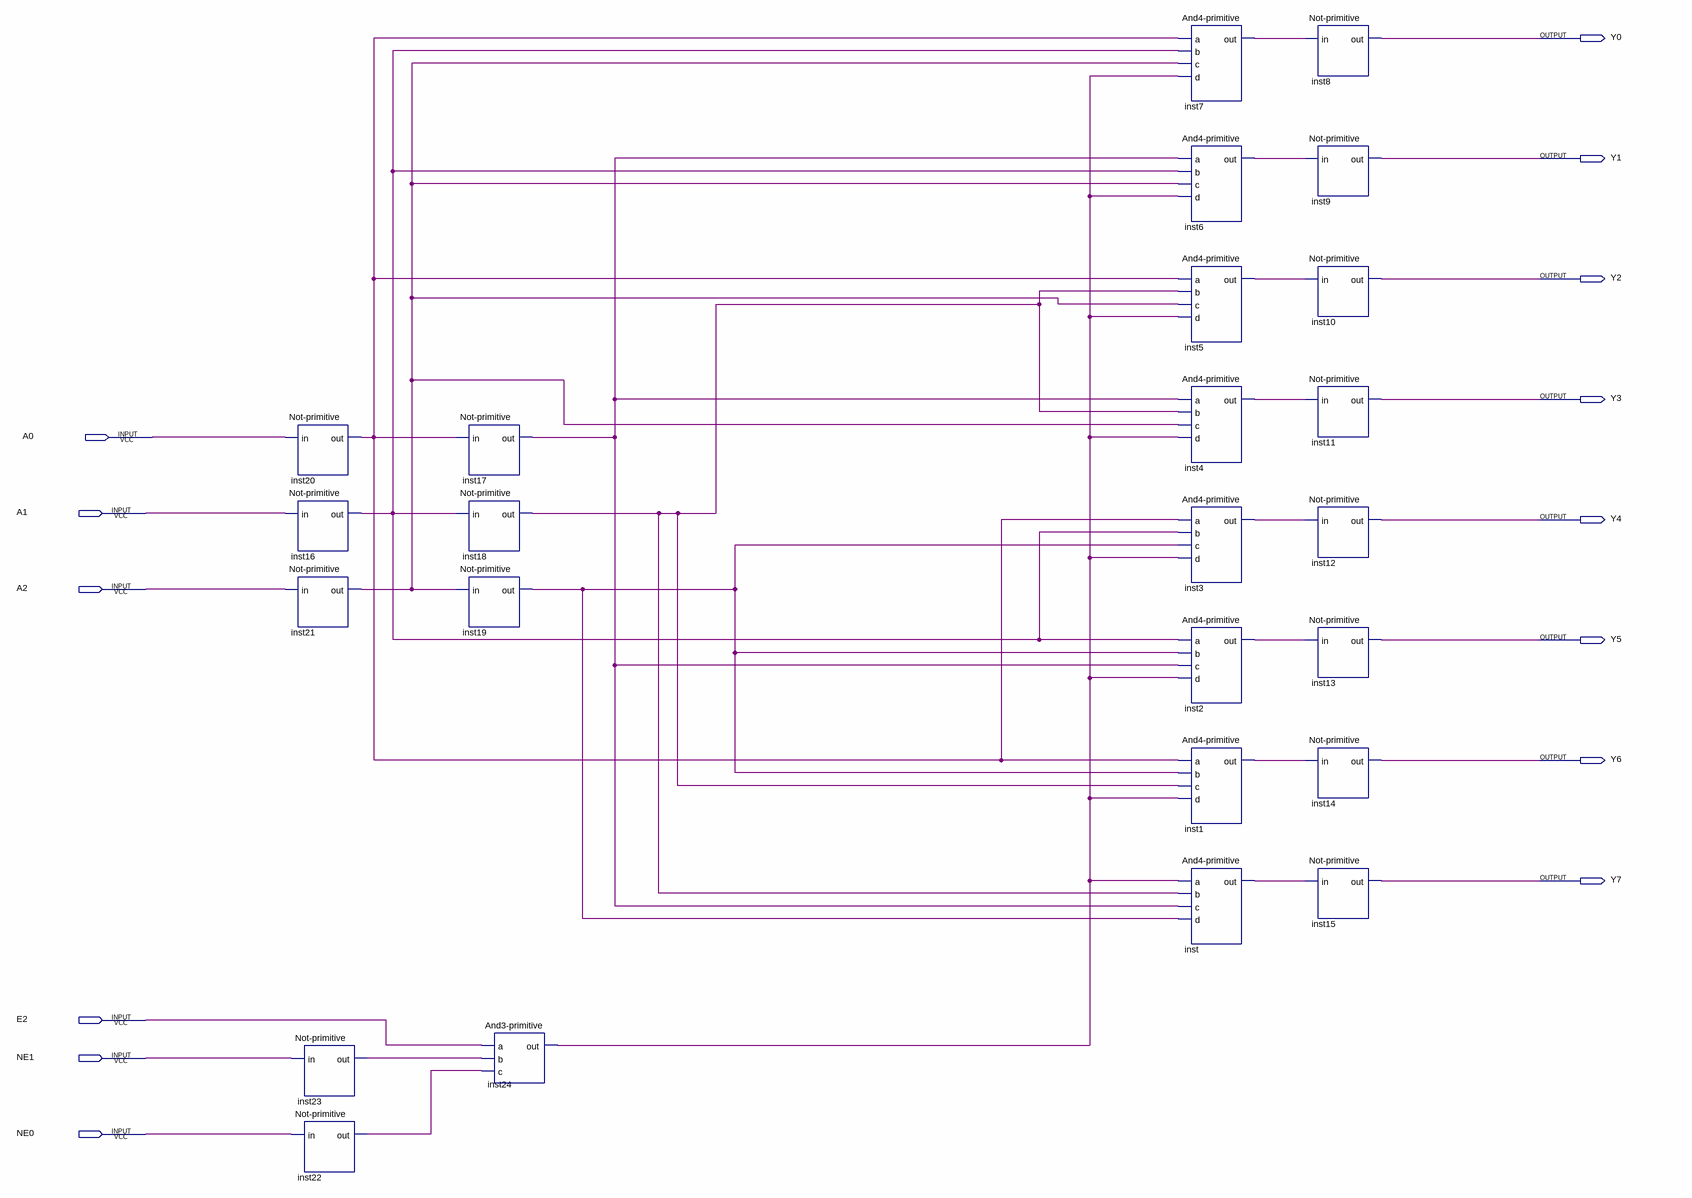
[diagram p0: schematic sheet]
// Quartus schematic 74138-Decoder.bdf as structural Verilog: 25 symbols, 14 pins
module \74138-Decoder  (
  input  A0,
  input  A1,
  input  A2,
  input  E2,
  input  NE1,
  input  NE0,
  output Y0,
  output Y1,
  output Y2,
  output Y3,
  output Y4,
  output Y5,
  output Y6,
  output Y7
);

  wire inst1_out, inst2_out, inst3_out, inst4_out, inst5_out, inst6_out, inst7_out, inst16_out, inst17_out,
       inst18_out, inst19_out, inst20_out, inst21_out, inst22_out, inst23_out, inst24_out, inst_out;

  \Not-primitive  inst20 (.in(A0), .out(inst20_out));
  \Not-primitive  inst16 (.in(A1), .out(inst16_out));
  \Not-primitive  inst21 (.in(A2), .out(inst21_out));
  \Not-primitive  inst23 (.in(NE1), .out(inst23_out));
  \Not-primitive  inst22 (.in(NE0), .out(inst22_out));
  \Not-primitive  inst17 (.in(inst20_out), .out(inst17_out));
  \Not-primitive  inst18 (.in(inst16_out), .out(inst18_out));
  \Not-primitive  inst19 (.in(inst21_out), .out(inst19_out));
  \And3-primitive  inst24 (.a(E2), .b(inst23_out), .c(inst22_out), .out(inst24_out));
  \And4-primitive  inst7 (.a(inst20_out), .b(inst16_out), .c(inst21_out), .d(inst24_out), .out(inst7_out));
  \And4-primitive  inst6 (.a(inst17_out), .b(inst16_out), .c(inst21_out), .d(inst24_out), .out(inst6_out));
  \And4-primitive  inst5 (.a(inst20_out), .b(inst18_out), .c(inst21_out), .d(inst24_out), .out(inst5_out));
  \And4-primitive  inst4 (.a(inst17_out), .b(inst18_out), .c(inst21_out), .d(inst24_out), .out(inst4_out));
  \And4-primitive  inst3 (.a(inst20_out), .b(inst16_out), .c(inst19_out), .d(inst24_out), .out(inst3_out));
  \And4-primitive  inst2 (.a(inst16_out), .b(inst19_out), .c(inst17_out), .d(inst24_out), .out(inst2_out));
  \And4-primitive  inst1 (.a(inst20_out), .b(inst19_out), .c(inst18_out), .d(inst24_out), .out(inst1_out));
  \And4-primitive  inst (.a(inst24_out), .b(inst18_out), .c(inst17_out), .d(inst19_out), .out(inst_out));
  \Not-primitive  inst8 (.in(inst7_out), .out(Y0));
  \Not-primitive  inst9 (.in(inst6_out), .out(Y1));
  \Not-primitive  inst10 (.in(inst5_out), .out(Y2));
  \Not-primitive  inst11 (.in(inst4_out), .out(Y3));
  \Not-primitive  inst12 (.in(inst3_out), .out(Y4));
  \Not-primitive  inst13 (.in(inst2_out), .out(Y5));
  \Not-primitive  inst14 (.in(inst1_out), .out(Y6));
  \Not-primitive  inst15 (.in(inst_out), .out(Y7));
endmodule
